# EAGLE schematic RoboArm Schematic (EAGLE 9.6.2)
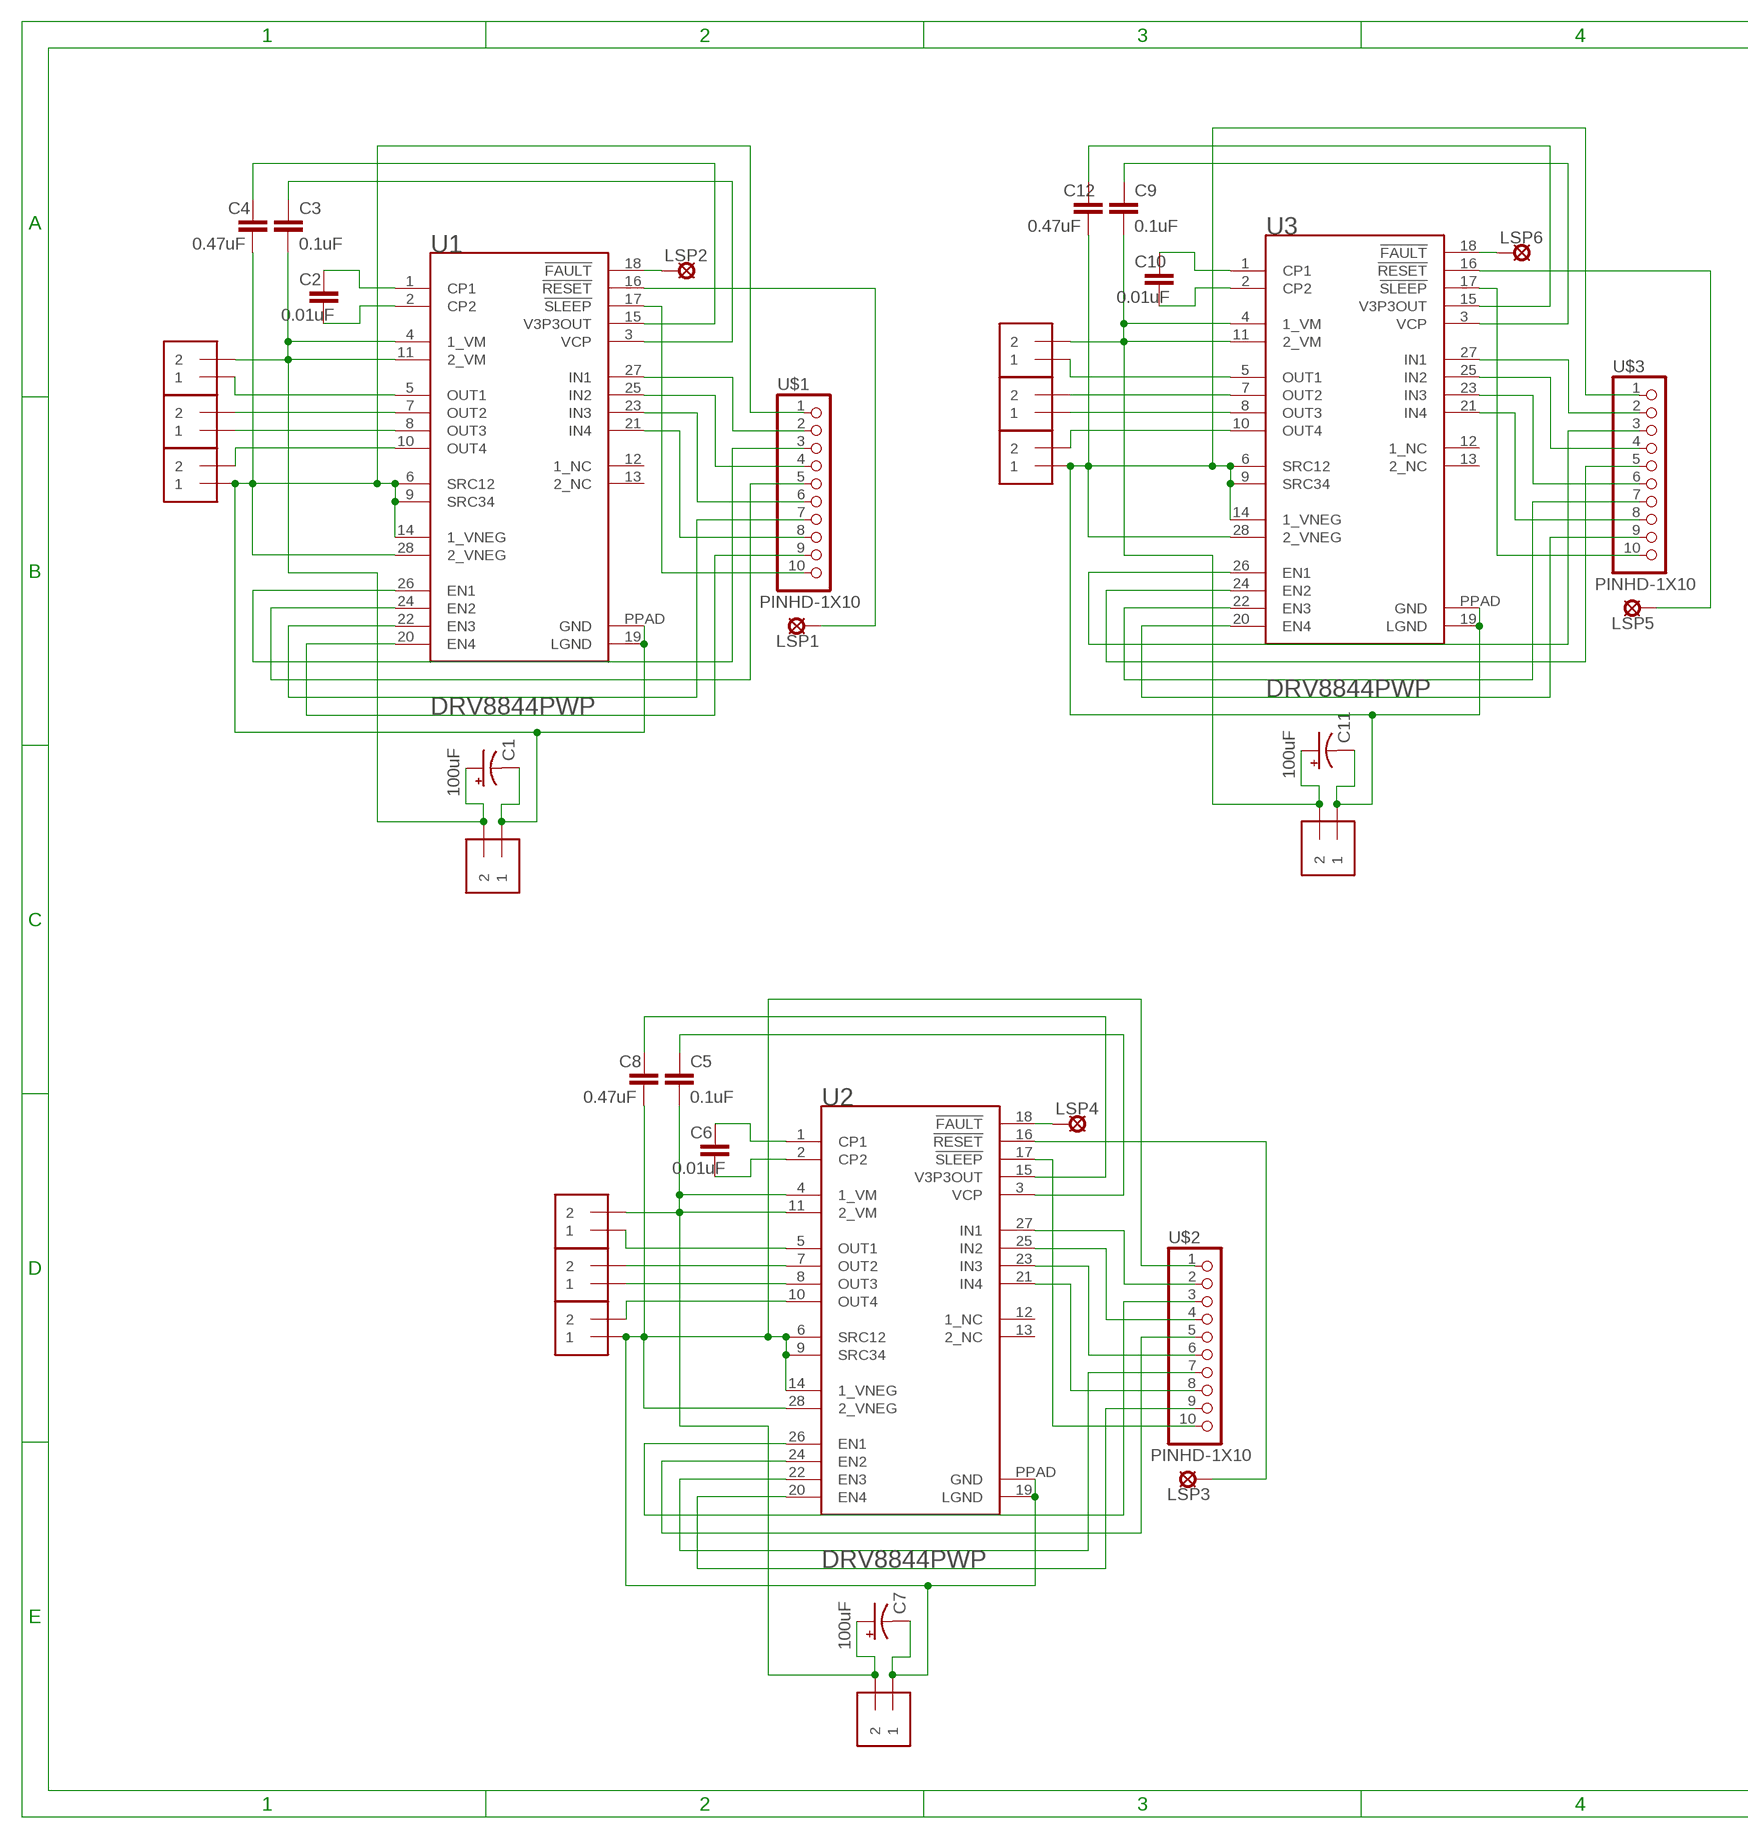
[diagram p0: schematic, sheet 1, part 1 of 2]
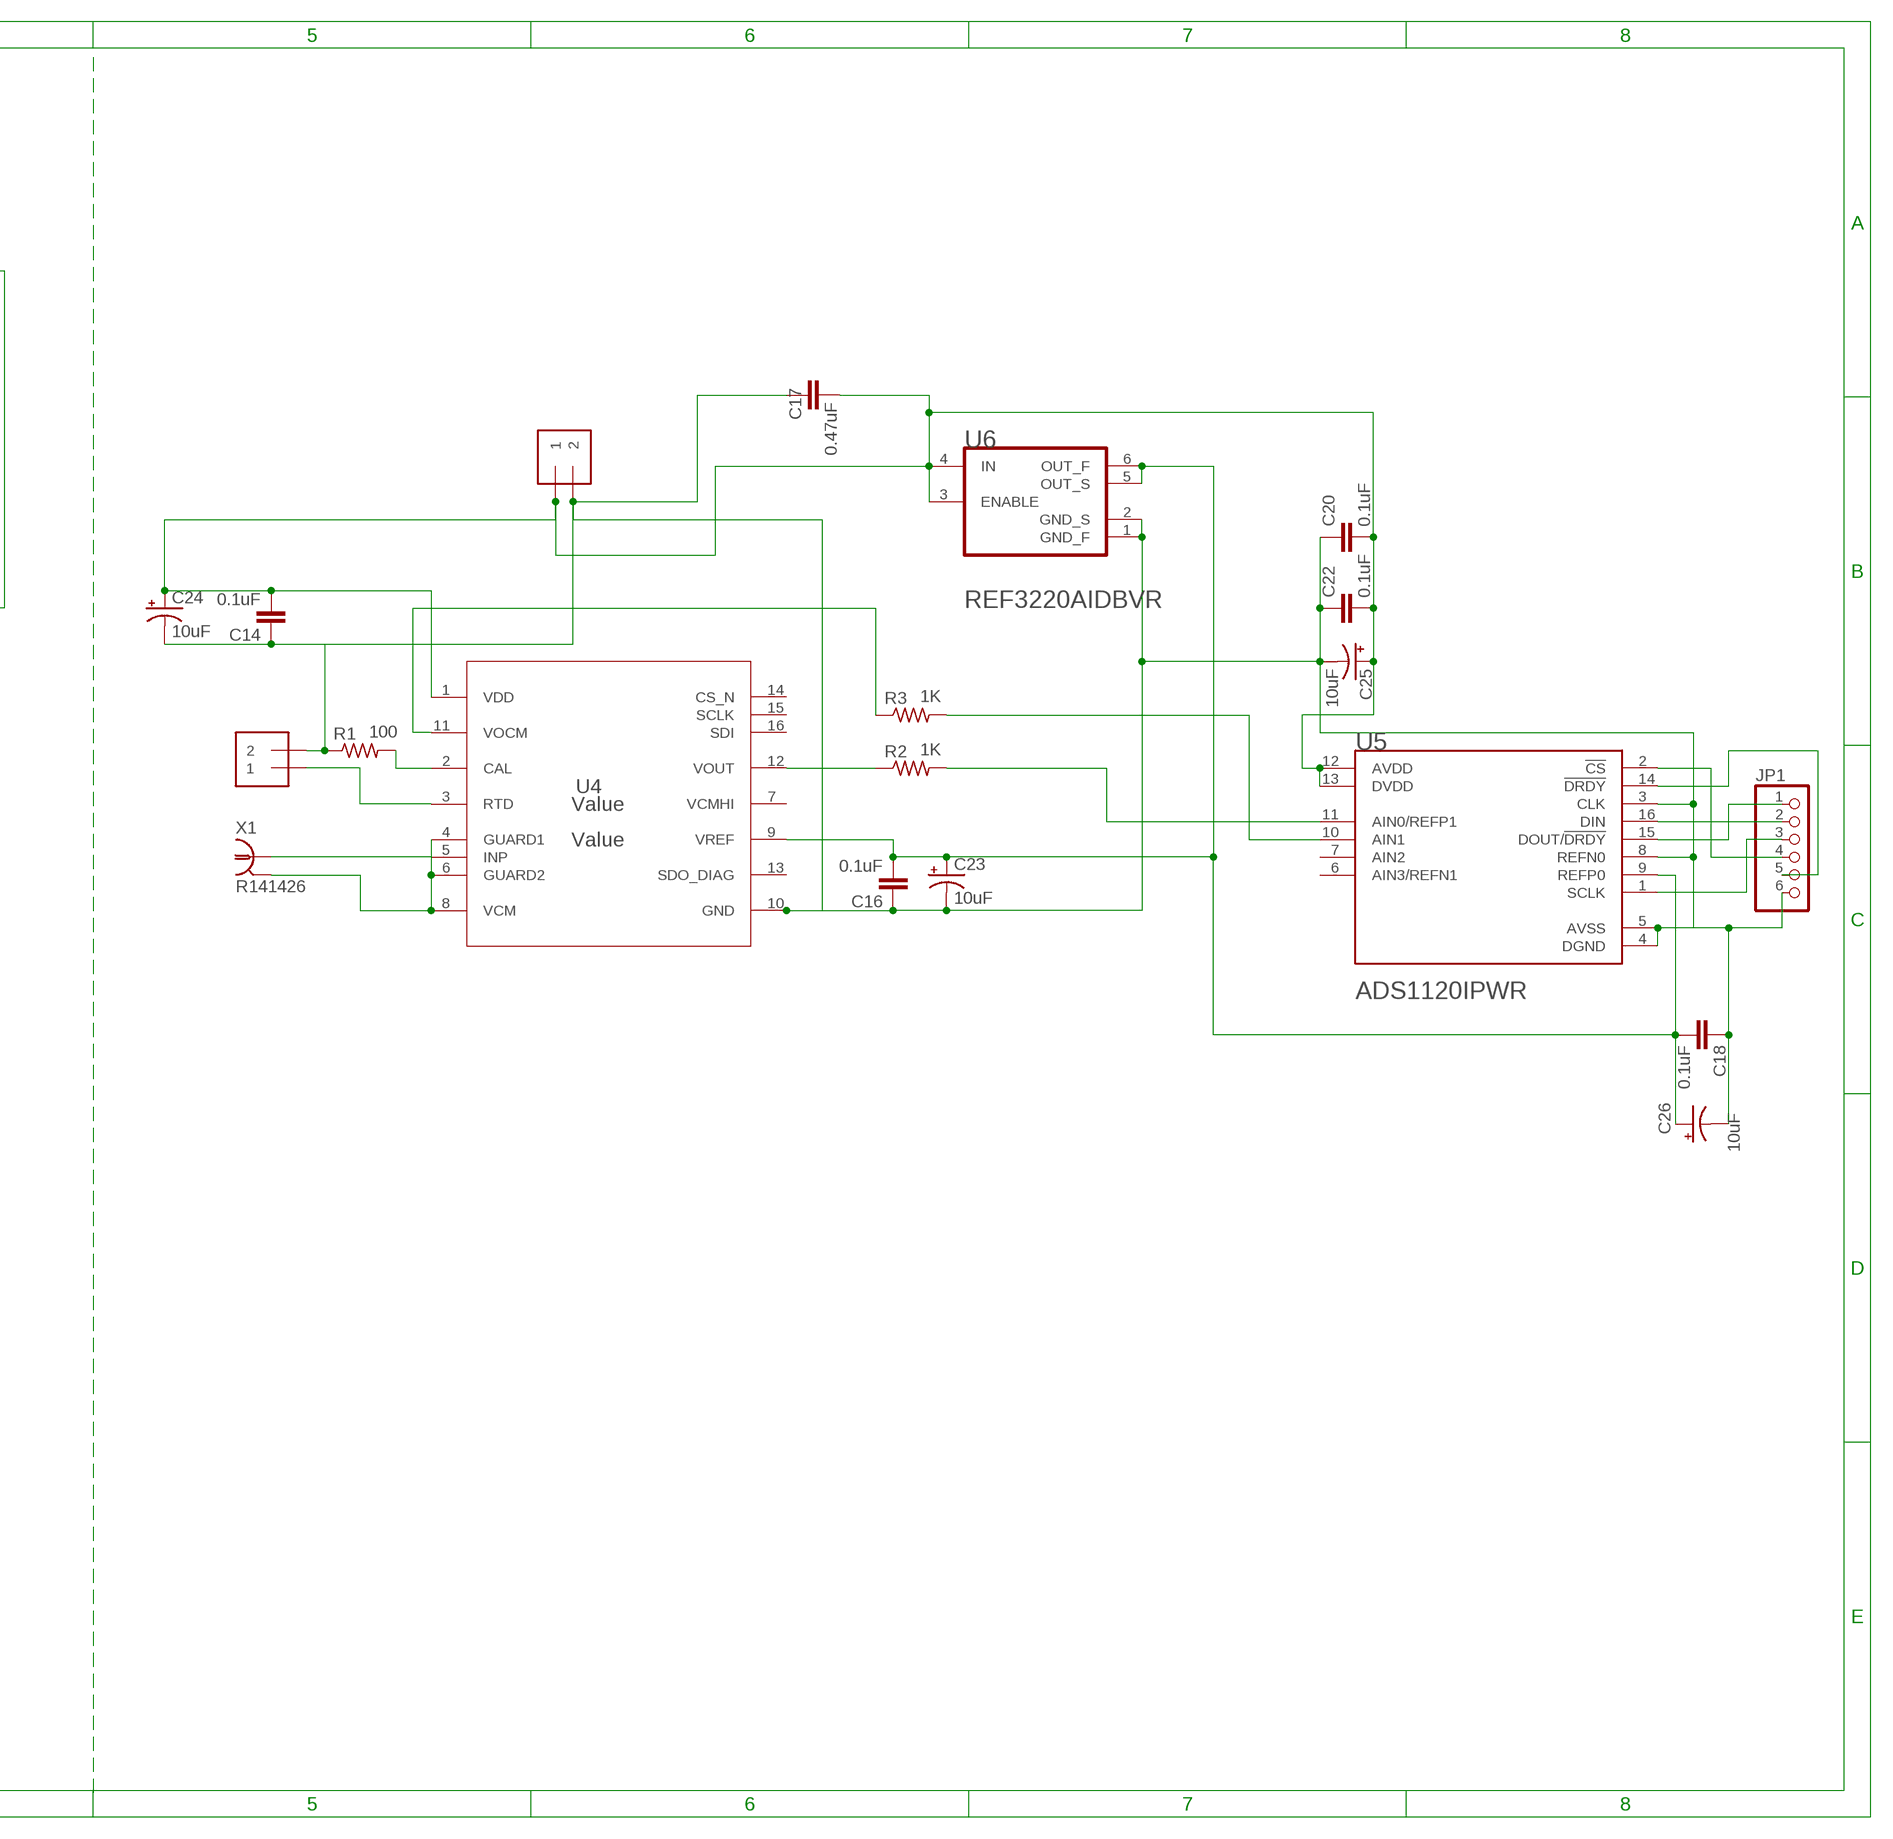
[diagram p1: schematic, sheet 1, part 2 of 2]

## Parts
C1  100uF  CPOL-USE5-8.5  [E5-8,5]
C2  0.01uF  C-EUC0805  [C0805]
C3  0.1uF  C-EUC0805  [C0805]
C4  0.47uF  C-EUC0805  [C0805]
C5  0.1uF  C-EUC0805  [C0805]
C6  0.01uF  C-EUC0805  [C0805]
C7  100uF  CPOL-USE5-8.5  [E5-8,5]
C8  0.47uF  C-EUC0805  [C0805]
C9  0.1uF  C-EUC0805  [C0805]
C10  0.01uF  C-EUC0805  [C0805]
C11  100uF  CPOL-USE5-8.5  [E5-8,5]
C12  0.47uF  C-EUC0805  [C0805]
C14  0.1uF  C-EUC0805  [C0805]
C16  0.1uF  C-EUC0805  [C0805]
C17  0.47uF  C-EUC0805  [C0805]
C18  0.1uF  C-EUC0805  [C0805]
C20  0.1uF  C-EUC0805  [C0805]
C22  0.1uF  C-EUC0805  [C0805]
C23  10uF  CPOL-USE2-4  [E2-4]
C24  10uF  CPOL-USE2-4  [E2-4]
C25  10uF  CPOL-USE2-4  [E2-4]
C26  10uF  CPOL-USE2-4  [E2-4]
J1  1X2-3.5MM  [1X2-3.5MM]
J2  1X2-3.5MM  [1X2-3.5MM]
J3  1X2-3.5MM  [1X2-3.5MM]
J4  1X2-3.5MM  [1X2-3.5MM]
J5  1X2-3.5MM  [1X2-3.5MM]
J6  1X2-3.5MM  [1X2-3.5MM]
J7  1X2-3.5MM  [1X2-3.5MM]
J8  1X2-3.5MM  [1X2-3.5MM]
J9  1X2-3.5MM  [1X2-3.5MM]
J10  1X2-3.5MM  [1X2-3.5MM]
J11  1X2-3.5MM  [1X2-3.5MM]
J12  1X2-3.5MM  [1X2-3.5MM]
J13  1X2-3.5MM  [1X2-3.5MM]
J15  1X2-3.5MM  [1X2-3.5MM]
JP1  PINHD-1X6  [1X06]
LSP1  SE11  [SE11]
LSP2  SE11  [SE11]
LSP3  SE11  [SE11]
LSP4  SE11  [SE11]
LSP5  SE11  [SE11]
LSP6  SE11  [SE11]
R1  100  R-US_M0805  [M0805]
R2  1K  R-US_M0805  [M0805]
R3  1K  R-US_M0805  [M0805]
U1  TEXAS_INSTRUMENTS_DRV8844PWPTEXAS_INSTRUMENTS_DRV8844PWP_0_0  [TEXAS_INSTRUMENTS_DRV8844PWP_0]
U2  TEXAS_INSTRUMENTS_DRV8844PWPTEXAS_INSTRUMENTS_DRV8844PWP_0_0  [TEXAS_INSTRUMENTS_DRV8844PWP_0]
U3  TEXAS_INSTRUMENTS_DRV8844PWPTEXAS_INSTRUMENTS_DRV8844PWP_0_0  [TEXAS_INSTRUMENTS_DRV8844PWP_0]
U4  Value  LMP91200MT/NOPBPW0016A_L  [PW0016A_L]
U5  TEXAS_INSTRUMENTS_ADS1120IPWRTEXAS_INSTRUMENTS_ADS1120IPWR_0_0  [TEXAS_INSTRUMENTS_ADS1120IPWR_0]
U6  TEXAS_INSTRUMENTS_REF3220AIDBVRTEXAS_INSTRUMENTS_REF3220AIDBVR_0_1  [TEXAS_INSTRUMENTS_REF3220AIDBVR_1]
U$1  PINHD-1X10  [1X10-BIG]
U$2  PINHD-1X10  [1X10-BIG]
U$3  PINHD-1X10  [1X10-BIG]
X1  R141426  [R141426]

## Nets
N$1: J2.1 U1.5(OUT1)
N$2: J3.2 U1.7(OUT2)
N$3: J3.1 U1.8(OUT3)
N$4: J4.2 U1.10(OUT4)
N$5: LSP2.MP U1.18(!FAULT!)
N$6: J6.1 U2.5(OUT1)
N$7: C2.2 U1.2(CP2)
N$8: C2.1 U1.1(CP1)
N$9: C1.+ C3.2 J1.2 J2.2 U1.4(1_VM) U1.11(2_VM)
N$10: C3.1 U1.3(VCP)
N$11: C4.1 U1.15(V3P3OUT)
N$12: C1.- C4.2 J1.1 J4.1 U1.6(SRC12) U1.9(SRC34) U1.14(1_VNEG) U1.19(LGND) U1.28(2_VNEG) U1.PPAD(GND) U$1.1
N$13: J7.2 U2.7(OUT2)
N$14: U1.27(IN1) U$1.2
N$15: U1.25(IN2) U$1.4
N$16: U1.26(EN1) U$1.3
N$17: U1.24(EN2) U$1.5
N$18: U1.23(IN3) U$1.6
N$19: U1.22(EN3) U$1.7
N$20: U1.21(IN4) U$1.8
N$21: U1.20(EN4) U$1.9
N$22: U1.17(!SLEEP!) U$1.10
N$23: LSP1.MP U1.16(!RESET!)
N$24: J7.1 U2.8(OUT3)
N$25: J8.2 U2.10(OUT4)
N$26: C6.2 U2.2(CP2)
N$27: C6.1 U2.1(CP1)
N$28: C5.2 C7.+ J5.2 J6.2 U2.4(1_VM) U2.11(2_VM)
N$29: C5.1 U2.3(VCP)
N$30: U2.27(IN1) U$2.2
N$31: U2.25(IN2) U$2.4
N$32: U2.26(EN1) U$2.3
N$33: U2.24(EN2) U$2.5
N$34: U2.23(IN3) U$2.6
N$35: U2.22(EN3) U$2.7
N$36: U2.21(IN4) U$2.8
N$37: U2.20(EN4) U$2.9
N$38: U2.17(!SLEEP!) U$2.10
N$39: LSP3.MP U2.16(!RESET!)
N$40: C8.1 U2.15(V3P3OUT)
N$41: LSP4.MP U2.18(!FAULT!)
N$42: C7.- C8.2 J5.1 J8.1 U2.6(SRC12) U2.9(SRC34) U2.14(1_VNEG) U2.19(LGND) U2.28(2_VNEG) U2.PPAD(GND) U$2.1
N$43: J10.1 U3.5(OUT1)
N$44: J11.2 U3.7(OUT2)
N$45: J11.1 U3.8(OUT3)
N$46: J12.2 U3.10(OUT4)
N$47: C10.2 U3.2(CP2)
N$48: C10.1 U3.1(CP1)
N$49: C9.2 C11.+ J9.2 J10.2 U3.4(1_VM) U3.11(2_VM)
N$50: C9.1 U3.3(VCP)
N$51: U3.27(IN1) U$3.2
N$52: U3.25(IN2) U$3.4
N$53: U3.26(EN1) U$3.3
N$54: U3.24(EN2) U$3.5
N$55: U3.23(IN3) U$3.6
N$56: U3.22(EN3) U$3.7
N$57: U3.21(IN4) U$3.8
N$58: U3.20(EN4) U$3.9
N$59: U3.17(!SLEEP!) U$3.10
N$60: LSP5.MP U3.16(!RESET!)
N$61: C12.1 U3.15(V3P3OUT)
N$62: LSP6.MP U3.18(!FAULT!)
N$63: C11.- C12.2 J9.1 J12.1 U3.6(SRC12) U3.9(SRC34) U3.14(1_VNEG) U3.19(LGND) U3.28(2_VNEG) U3.PPAD(GND) U$3.1
N$65: U4.5(INP) X1.1
N$66: R2.1 U4.12(VOUT)
N$67: U4.4(GUARD1) U4.6(GUARD2) U4.8(VCM) X1.2 X1.3 X1.4 X1.5
N$68: R1.2 U4.2(CAL)
N$69: J13.1 U4.3(RTD)
N$70: R3.1 U4.11(VOCM)
N$71: R2.2 U5.11(AIN0/REFP1)
N$74: R3.2 U5.10(AIN1)
N$75: C14.1 C16.1 C17.1 C18.1 C20.1 C22.1 C23.- C24.- C25.- C26.- J13.2 J15.2 JP1.6 R1.1 U4.10(GND) U5.3(CLK) U5.4(DGND) U5.5(AVSS) U5.8(REFN0) U6.1(GND_F) U6.2(GND_S)
N$76: JP1.1 U5.15(DOUT/!DRDY!)
N$77: C14.2 C17.2 C20.2 C22.2 C24.+ C25.+ J15.1 U4.1(VDD) U5.12(AVDD) U5.13(DVDD) U6.3(ENABLE) U6.4(IN)
N$78: JP1.2 U5.16(DIN)
N$79: JP1.3 U5.1(SCLK)
N$80: JP1.4 U5.2(!CS!)
N$81: JP1.5 U5.14(!DRDY!)
N$82: C16.2 C18.2 C23.+ C26.+ U4.9(VREF) U5.9(REFP0) U6.5(OUT_S) U6.6(OUT_F)
Unconnected: U1.12(1_NC) U1.13(2_NC) U2.12(1_NC) U2.13(2_NC) U3.12(1_NC) U3.13(2_NC) U4.7(VCMHI) U4.13(SDO_DIAG) U4.14(CS_N) U4.15(SCLK) U4.16(SDI) U5.6(AIN3/REFN1) U5.7(AIN2)

## Library data of the parts
C1 C7 C11 C23-C26 = adafruit:CPOL-US: POLARIZED CAPACITOR, American symbol
C2-C6 C8-C10 C12 C14 C16-C18 C20 C22 = rcl:C-EU: CAPACITOR, European symbol; SPICEPREFIX: C
J1-J13 J15 = adafruit:1X2: 3.5mm Terminal block http://www.ladyada.net/library/pcb/eaglelibrary.html
JP1 = adafruit:PINHD-1X6: PIN HEADER
LSP1-LSP6 = solpad:SE11: SOLDER PAD RTM, drill 1,1mm, distributor Buerklin, 07F810
R1-R3 = rcl:R-US_: RESISTOR, American symbol; SPICEPREFIX: R
U1-U3 = Texas Instruments - DRV8844PWP:TEXAS_INSTRUMENTS_DRV8844PWP: DRV8844 Quad ½-H-Bridge Driver IC; AMBIENT_TEMPERATURE_RANGE_HIGH: +125°C; AMBIENT_TEMPERATURE_RANGE_LOW: -40°C; CENTROID_NOT_SPECIFIED: No; DATASHEET: http://www.ti.com/lit/ds/symlink/drv8844.pdf; DEVICE_CLASS_L1: Integrated Circuits (ICs); DEVICE_CLASS_L2: Power Management ICs; DEVICE_CLASS_L3: Motor Drivers; DIGIKEY_DESCRIPTION: IC MOTOR DRIVER PAR 28HTSSOP; DIGIKEY_PART_NUMBER: 296-46510-5-ND; HEIGHT: 1.2mm; LEAD_FREE: yes; MAX_JUNCTION_TEMP: +150°C; MAX_SUPPLY_VOLTAGE: 60V; MF: Texas Instruments; MFG_PACKAGE_IDENT: PWP0028C; MFG_PACKAGE_IDENT_DATE: 0; MFG_PACKAGE_IDENT_REV: 0; MIN_SUPPLY_VOLTAGE: 8V; MOTOR_TYPE: Stepper; MOUSER_DESCRIPTION: Motor / Motion / Ignition Controllers & Drivers Brushed DC motor Solenoid/Relay Drvr; MOUSER_PART_NUMBER: 595-DRV8844PWP; MPN: DRV8844PWP; NOMINAL_SUPPLY_CURRENT: 1mA; NUMBER_OF_OUTPUTS: 4; PACKAGE: HTSSOP28; PREFIX: U; ROHS: yes; STANDOFF_HEIGHT: 0.05mm; TEMPERATURE_RANGE_HIGH: +85°C; TEMPERATURE_RANGE_LOW: -40°C; VERIFICATION_VERSION: 0.0.0.1
U4 = LMP91200:LMP91200MT/NOPB; ALTERNATE_PARTNUMBER: LMP91200MT/NOPB; COMPTYPE: IC; MANUFACTURER: Texas Instruments; MOUNTTYPE: SMT; PACKAGEREFERENCE: PW0016A; PARTNUMBER: LMP91200MTX/NOPB; PIN_COUNT: 16; REFDES: RefDes; ROHS: Y; TYPE: TYPE
U5 = Texas Instruments - ADS1120IPWR:TEXAS_INSTRUMENTS_ADS1120IPWR: Analogue to Digital Converter, 16 bit, 2 kSPS, Single, 2.3 V, 5.5 V, TSSOP; CENTROID_NOT_SPECIFIED: No; DATASHEET: http://www.ti.com/lit/ds/symlink/ads1120.pdf; DIGIKEY_DESCRIPTION: IC ADC CONV 16BIT LP LN 16TSSOP; DIGIKEY_PART_NUMBER: 296-37280-1-ND; LEAD_FREE: yes; MF: Texas Instruments; MFG_PACKAGE_IDENT: PW (R-PDSO-G16); MFG_PACKAGE_IDENT_DATE: 02/11; MFG_PACKAGE_IDENT_REV: G; MOUSER_PART_NUMBER: 595-ADS1120IPWR; MPN: ADS1120IPWR; PACKAGE: TSSOP16; PREFIX: U; ROHS: yes; TEMPERATURE_RANGE_HIGH: +125°C; TEMPERATURE_RANGE_LOW: -40°C
U6 = Texas Instruments - REF3220AIDBVR:TEXAS_INSTRUMENTS_REF3220AIDBVR: TI-REF3220DBV6; CIIVA_IDS: 2916718; CODE__JEDEC: MO-178; COMPONENT_LINK_1_DESCRIPTION: Manufacturer URL; COMPONENT_LINK_1_URL: http://www.ti.com/; COMPONENT_LINK_3_DESCRIPTION: Package Specification; COMPONENT_LINK_3_URL: http://www.ti.com/litv/pdf/mpds026h; DATASHEET: http://www.ti.com/general/docs/lit/getliterature.tsp?genericPartNumber=REF3220&fileType=pdf; DATASHEET_VERSION: SBVS058C; FOOTPRINT_VARIANT_NAME_0: Level C; FOOTPRINT_VARIANT_NAME_1: Level B; FOOTPRINT_VARIANT_NAME_2: Level A; IMPORTED: yes; IMPORTED_FROM: vault; IMPORT_TS: 1521865782; INITIAL_ACCURACY__25DEG_C: 0.2; IOUT_IZ_MAXM_A: 10; IQ_MAXU_A: 120; MF: Texas Instruments; MOUNTING_TECHNOLOGY: Surface Mount; MPN: REF3220AIDBVR; PACKAGE: DBV0006A; PACKAGE_DESCRIPTION: 6-Pin Plastic Small Outline, Body 1.60 Ã— 2.90 mm, Pitch 0.95 mm; PACKAGE_VERSION: 4073253-5/K; PREFIX: U; RATING: Catalog; RELEASE_DATE: 1464594691; ROHS: Yes; SUB_FAMILY: Series Voltage Reference; TEMP_COEFFMAXPPM_DEGREE_C: 7; TEMP_COEFFTYPPPM_DEGREE_C: 4; VAULT_GUID: 2EDC43C8-66F4-4E8E-B796-F9B110D5B6D3; VAULT_REVISION: 8C93BD7F-AEC2-45C7-B35F-C6839A5AF6A7; VI_MAX_V: 5.5; VI_MIN_V: 2.098; VO_V: 2.048
U$1-U$3 = adafruit:PINHD-1X10: Pin header 1x10 0.1" spacing With round pins
X1 = con-coax:R141426: BNC COAX CONNECTOR Radiall 50/75 Ohm Spoerle; MF: FARNELL; MPN: R141426161; OC_FARNELL: 4195115; OC_NEWARK: 14J7919